# EAGLE design Wandering_point (EAGLE 9.5.2)
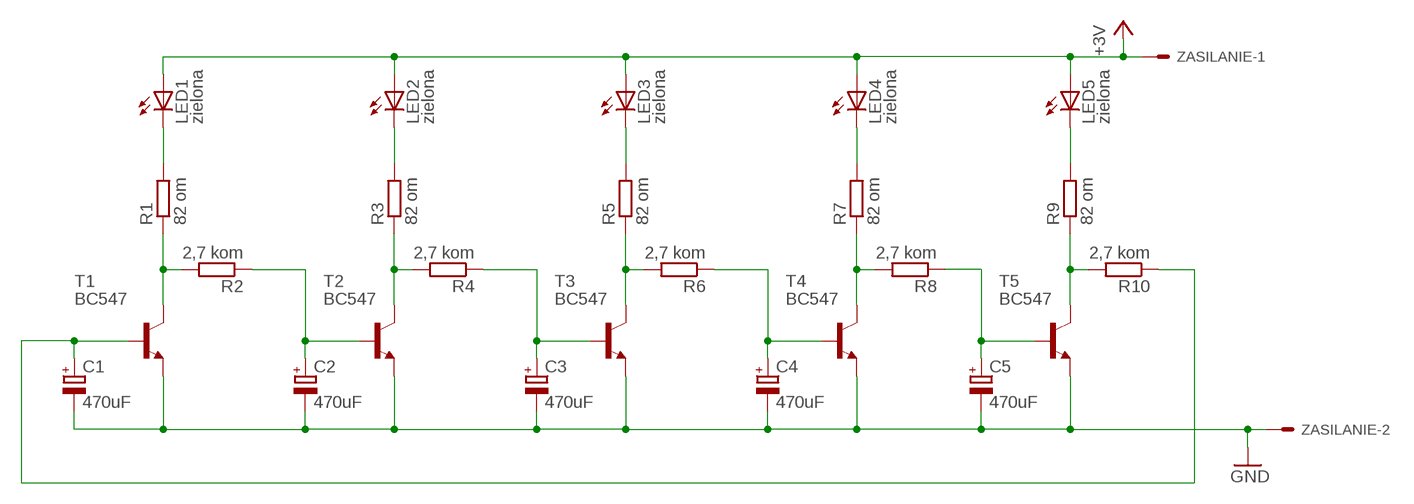
[diagram p0: schematic, sheet 1]

## Parts
C1  470uF  CPOL-EUE7.5-16  [E7,5-16]
C2  470uF  CPOL-EUE7.5-16  [E7,5-16]
C3  470uF  CPOL-EUE7.5-16  [E7,5-16]
C4  470uF  CPOL-EUE7.5-16  [E7,5-16]
C5  470uF  CPOL-EUE7.5-16  [E7,5-16]
LED1  zielona  LED5MM  [LED5MM]
LED2  zielona  LED5MM  [LED5MM]
LED3  zielona  LED5MM  [LED5MM]
LED4  zielona  LED5MM  [LED5MM]
LED5  zielona  LED5MM  [LED5MM]
R1  82 om  R-EU_VMTA55  [VMTA55]
R2  2,7 kom  R-EU_VMTA55  [VMTA55]
R3  82 om  R-EU_VMTA55  [VMTA55]
R4  2,7 kom  R-EU_VMTA55  [VMTA55]
R5  82 om  R-EU_VMTA55  [VMTA55]
R6  2,7 kom  R-EU_VMTA55  [VMTA55]
R7  82 om  R-EU_VMTA55  [VMTA55]
R8  2,7 kom  R-EU_VMTA55  [VMTA55]
R9  82 om  R-EU_VMTA55  [VMTA55]
R10  2,7 kom  R-EU_VMTA55  [VMTA55]
T1  BC547  [TO92]
T2  BC547  [TO92]
T3  BC547  [TO92]
T4  BC547  [TO92]
T5  BC547  [TO92]
ZASILANIE  332-02  [332-02]

## Nets
+3V3: LED1.A LED2.A LED3.A LED4.A LED5.A ZASILANIE.1 ; supply symbol labelled +3V
GND: C1.- C2.- C3.- C4.- C5.- T1.1(E) T2.1(E) T3.1(E) T4.1(E) T5.1(E) ZASILANIE.2
N$1: R1.1 R2.2 T1.3(C)
N$2: LED1.K(C) R1.2
N$6: R3.1 R4.2 T2.3(C)
N$7: LED2.K(C) R3.2
N$8: C2.+ R2.1 T2.2(B)
N$9: R5.1 R6.2 T3.3(C)
N$10: C3.+ R4.1 T3.2(B)
N$11: LED3.K(C) R5.2
N$14: R7.1 R8.2 T4.3(C)
N$15: LED4.K(C) R7.2
N$16: C4.+ R6.1 T4.2(B)
N$19: R9.1 R10.2 T5.3(C)
N$20: LED5.K(C) R9.2
N$21: C5.+ R8.1 T5.2(B)
N$22: C1.+ R10.1 T1.2(B)

## Library data of the parts
C1 C2 C4 C5 = resistor:CPOL-EU: POLARIZED CAPACITOR, European symbol
C3 = resistor:CPOL-EU: POLARIZED CAPACITOR, European symbol; SPICEPREFIX: C
LED1-LED5 = led:LED: LED OSRAM: - CHIPLED LG R971, LG N971, LY N971, LG Q971, LY Q971, LO R971, LY R971 LH N974, LH R974 LS Q976, LO Q976, LY Q976 LO Q996 - Hyper CHIPLED LW Q18S LB Q993, LB Q99A, LB R99A - SideLED LS A670, LO A670, LY A670, LG A670, LP A670 LB A673, LV A673, LT A673, LW A673 LH A674 LY A675 LS A676, LA A676, LO A676, LY A676, LW A676 LS A679, LY A679, LG A679 - Hyper Micro SIDELED® LS Y876, LA Y876, LO Y876, LY Y876 LT Y87S - SmartLED LW L88C, LW L88S LB L89C, LB L89S, LG L890 LS L89K, LO L89K, LY L89K LS L896, LA L896, LO L896, LY L896 - TOPLED LS T670, LO T670, LY T670, LG T670, LP T670 LSG T670, LSP T670, LSY T670, LOP T670, LYG T670 LG T671, LOG T671, LSG T671 LB T673, LV T673, LT T673, LW T673 LH T674 LS T676, LA T676, LO T676, LY T676, LB T676, LH T676, LSB T676, LW T676 LB T67C, LV T67C, LT T67C, LS T67K, LO T67K, LY T67K, LW E67C LS E67B, LA E67B, LO E67B, LY E67B, LB E67C, LV E67C, LT E67C LW T67C LS T679, LY T679, LG T679 LS T770, LO T770, LY T770, LG T770, LP T770 LB T773, LV T773, LT T773, LW T773 LH T774 LS E675, LA E675, LY E675, LS T675 LS T776, LA T776, LO T776, LY T776, LB T776 LHGB T686 LT T68C, LB T68C - Hyper Mini TOPLED® LB M676 - Mini TOPLED Santana® LG M470 LS M47K, LO M47K, LY M47K Source: http://www.osram.convergy.de LUXEON: - LUMILED® LXK2-PW12-R00, LXK2-PW12-S00, LXK2-PW14-U00, LXK2-PW14-V00 LXK2-PM12-R00, LXK2-PM12-S00, LXK2-PM14-U00 LXK2-PE12-Q00, LXK2-PE12-R00, LXK2-PE12-S00, LXK2-PE14-T00, LXK2-PE14-U00 LXK2-PB12-K00, LXK2-PB12-L00, LXK2-PB12-M00, LXK2-PB14-N00, LXK2-PB14-P00, LXK2-PB14-Q00 LXK2-PR12-L00, LXK2-PR12-M00, LXK2-PR14-Q00, LXK2-PR14-R00 LXK2-PD12-Q00, LXK2-PD12-R00, LXK2-PD12-S00 LXK2-PH12-R00, LXK2-PH12-S00 LXK2-PL12-P00, LXK2-PL12-Q00, LXK2-PL12-R00 Source: www.luxeon.com KINGBRIGHT: KA-3528ASYC Source: www.kingbright.com
R1-R10 = rcl:R-EU_: RESISTOR, European symbol; SPICEPREFIX: R
T1-T5 = transistor-neu-to92:BC547: NPN TRANSISTOR
ZASILANIE = con-garry:332-02: 2 Pin - 2mm Dual Row Source: www.mpe-connector.de / garry_shortform_2012.pdf

## Board
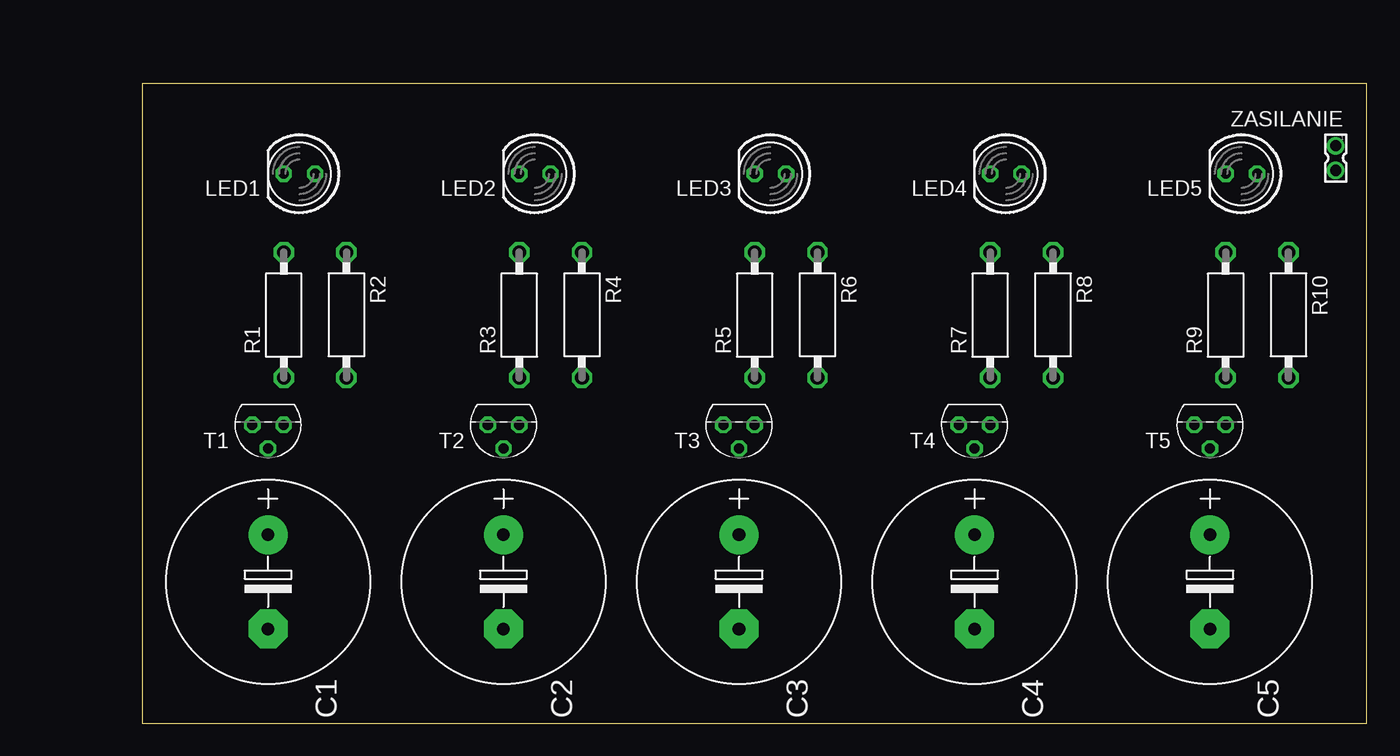
[diagram p1: board, top side]
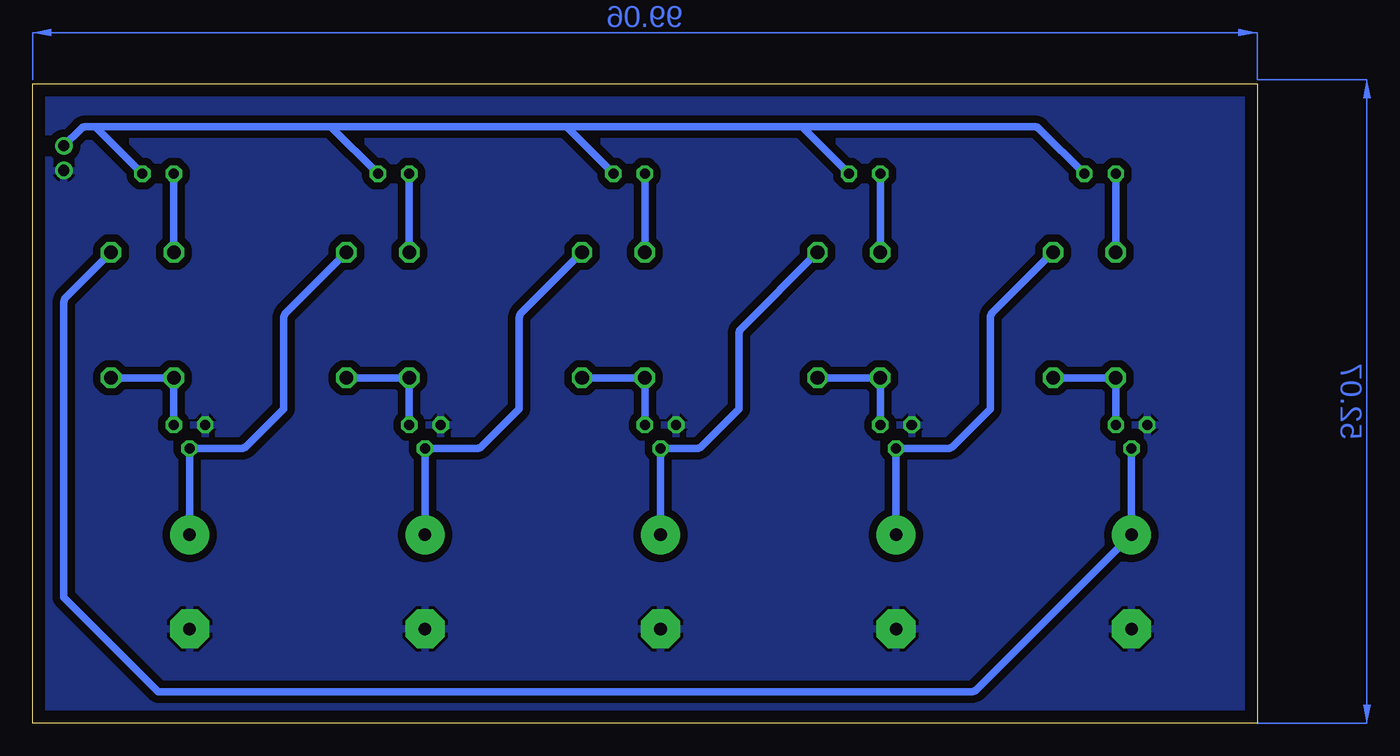
[diagram p2: board, bottom side, seen from below]

Size 99.04 x 51.74 mm. Coordinates in mm from the lower left corner, seen from the top.
Outline: 0,0 99.04,0 99.04,51.74 0,51.74 0,0
Copper layers (1*16): Top 0.035mm / dielectric 1.5mm / Bottom 0.035mm
Design rules "default": minimum track width 6mil, minimum drill 0.35mm, track to track 6mil, track to pad 6mil, pad to pad 6mil, via to via 6mil, smd to smd 6mil, copper to edge 40mil, drill to drill 6mil, minimum pad ring 10mil, minimum via ring 8mil, stop-mask expansion 4mil, vias tented up to drill 0mil, thermal gap 10mil

### Footprints (pad centres in the part's own frame; a part is rotated, then mirrored left to right if it is on the bottom)
E7,5-16 = drill 1.016 pad 3.15: + -3.81,0 | drill 1.016 pad 3.15 octagon: - 3.81,0
LED5MM = drill 0.813 octagon: A -1.27,0; K 1.27,0
VMTA55 = drill 1.1 octagon: 1 -5.08,0; 2 5.08,0
TO92 = drill 0.813 octagon: 1 1.27,0; 2 0,1.905; 3 -1.27,0
332-02 = drill 0.9 pad 1.27: 1 0,-1; 2 0,1

### Placement (x,y rotation side)
C1  10.16,11.43 270 top
C2  29.21,11.43 270 top
C3  48.26,11.43 270 top
C4  67.31,11.43 270 top
C5  86.36,11.43 270 top
LED1  12.7,44.45 180 top
LED2  31.75,44.45 180 top
LED3  50.8,44.45 180 top
LED4  69.85,44.45 180 top
LED5  88.9,44.45 180 top
R1  11.43,33.02 90 top
R2  16.51,33.02 270 top
R3  30.48,33.02 90 top
R4  35.56,33.02 270 top
R5  49.53,33.02 90 top
R6  54.61,33.02 270 top
R7  68.58,33.02 90 top
R8  73.66,33.02 270 top
R9  87.63,33.02 90 top
R10  92.71,33.02 270 top
T1  10.16,24.13 180 top
T2  29.21,24.13 180 top
T3  48.26,24.13 180 top
T4  67.31,24.13 180 top
T5  86.36,24.13 180 top
ZASILANIE  96.52,45.72 180 top

### Tracks (layer width: path | path; a pad name or v marks a point on that pad's centre or on a via)
+3V3
  Bottom 0.61: LED1.A 17.59,48.07 arc-45 18.04,48.26 36.83,48.26 | ZASILANIE.1 95.17,48.07 arc45 94.72,48.26 93.98,48.26 | 36.83,48.26 55.88,48.26 | 55.88,48.26 74.93,48.26 | 74.93,48.26 93.98,48.26 | LED2.A 36.83,48.26 | LED3.A 55.88,48.26 | LED4.A 74.93,48.26 | LED5.A 93.98,48.26
GND
  pour Bottom (isolate 0.61): 0,52.07 99.06,52.07 99.06,0 0,0
N$1
  Bottom 0.61: R2.2 R1.1 T1.3
N$2
  Bottom 0.61: LED1.K R1.2
N$6
  Bottom 0.61: T2.3 R3.1 R4.2
N$7
  Bottom 0.61: LED2.K R3.2
N$8
  Bottom 0.61: R2.1 21.4,33.21 arc-45 21.59,32.76 21.59,25.4 24.58,22.41 arc45 25.03,22.23 T2.2 C2.+
N$9
  Bottom 0.61: T3.3 R5.1 R6.2
N$10
  Bottom 0.61: R4.1 41.72,31.94 arc-45 41.91,31.49 41.91,25.4 44.9,22.41 arc45 45.35,22.23 T3.2 C3.+
N$11
  Bottom 0.61: LED3.K R5.2
N$14
  Bottom 0.61: T4.3 R7.1 R8.2
N$15
  Bottom 0.61: LED4.K R7.2
N$16
  Bottom 0.61: R6.1 59.5,33.21 arc-45 59.69,32.76 59.69,25.4 62.68,22.41 arc45 63.13,22.23 T4.2 C4.+
N$19
  Bottom 0.61: R10.2 R9.1 T5.3
N$20
  Bottom 0.61: LED5.K R9.2
N$21
  Bottom 0.61: R8.1 78.55,33.21 arc-45 78.74,32.76 78.74,25.4 81.73,22.41 arc45 82.18,22.23 T5.2 C5.+
N$22
  Bottom 0.61: T1.2 C1.+ 22.67,2.73 arc45 23.12,2.54 88.9,2.54 96.52,10.16 96.52,34.03 arc45 96.33,34.48 R10.1
(copper drawn outside any net)
  shapes: Bottom area x2